# Altium project smart-ppe.PrjPcb (part 2 of 3)

## Sheet Power.SchDoc: Power
size C; Author: Alexander Curtiss; DocumentNumber: 3; SheetNumber: 3; SheetTotal: 6
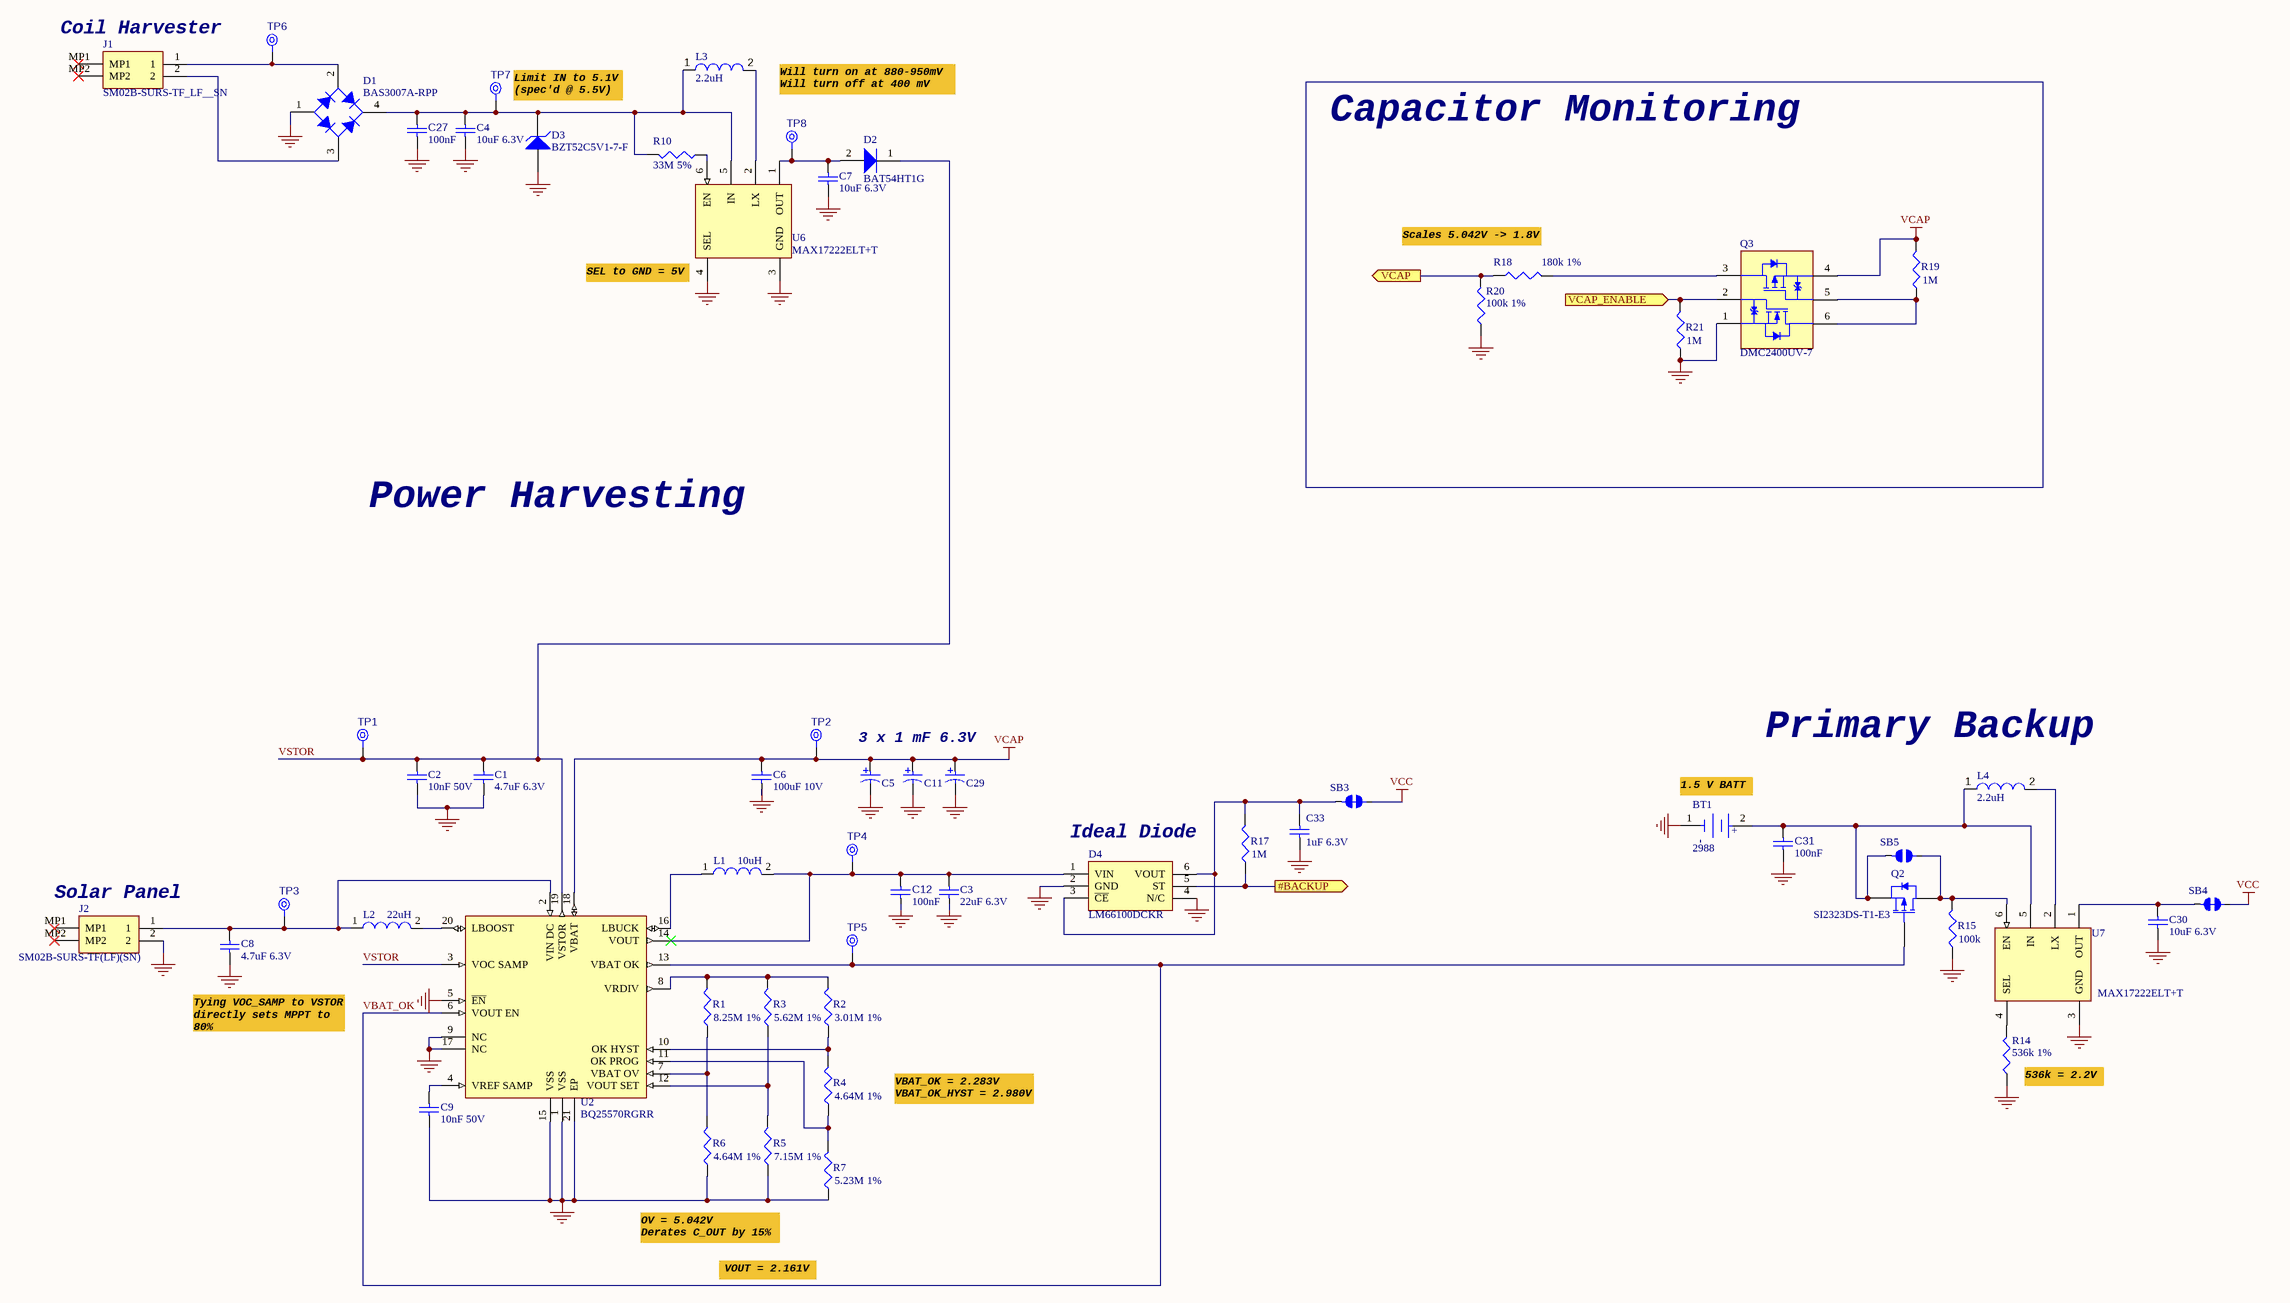
[diagram p4: Power.SchDoc]

### Parts
BT1  2988  [FP-2988-MFG]
C1  4.7uF 6.3V  [CAPC1005X55X25NL05T10]
C2  10nF 50V  [CAPC1005X55X25NL05T10]
C3  22uF 6.3V  [CAPC1608X100X20NL10]
C4  10uF 6.3V  [CAPC1608X90X35NL10T15]
C5  T495X108K006ATE100  [CAPM3216X18N]  (value not drawn)
C6  100uF 10V  [TDK-C3216-2_H1.9_M]
C7  10uF 6.3V  [CAPC1608X90X35NL10T15]
C8  4.7uF 6.3V  [CAPC1005X55X25NL05T10]
C9  10nF 50V  [CAPC1005X55X25NL05T10]
C11  T495X108K006ATE100  [CAPM3216X18N]  (value not drawn)
C12  value 100nF  [CAPC0402(1005)60_L]  (hidden comment: Capacitor 100nF +/-20% 25V 0402)
C27  value 100nF  [CAPC0402(1005)60_L]  (hidden comment: Capacitor 100nF +/-20% 25V 0402)
C29  T495X108K006ATE100  [CAPM3216X18N]  (value not drawn)
C30  10uF 6.3V  [CAPC1608X90X35NL10T15]
C31  value 100nF  [CAPC0402(1005)60_L]  (hidden comment: Capacitor 100nF +/-20% 25V 0402)
C33  1uF 6.3V  [CAPC1005X55X25ML5T10]
D1  BAS3007A-RPP  [INF-SOT143_V]
D2  BAT54HT1G  [ONSC-SOD-323-2-477-02_V]
D3  BZT52C5V1-7-F  [DIOD-SOD123_V]
D4  LM66100DCKR  [SOP65P210X110-6N]
J1  SM02B-SURS-TF_LF__SN  [SM02BSURSTFLFSN]
J2  SM02B-SURS-TF(LF)(SN)  [SM02BSURSTFLFSN]
L1  10uH  [WE-TPC-2813-TH]
L2  22uH  [WE-TPC-3816-S]
L3  Inductance: 2.2uH  [74438357022]  (hidden comment: 74438357022)
L4  Inductance: 2.2uH  [74438357022]  (hidden comment: 74438357022)
Q2  SI2323DS-T1-E3  [VISH-SI2323DS-T1-E3-3_V]
Q3  DMC2400UV-7  [DIOD-SOT563-6_V]
R1  8.25M 1%  [RESC1608X55X25NL10T15]
R2  3.01M 1%  [RESC1608X55X25NL10T15]
R3  5.62M 1%  [RESC1608X55X25NL10T15]
R4  4.64M 1%  [RESC1608X55X25NL10T15]
R5  7.15M 1%  [RESC1608X55X25NL10T15]
R6  4.64M 1%  [RESC1608X55X25NL10T15]
R7  5.23M 1%  [RESC1608X55X25NL10T15]
R10  33M 5%  [RESC1608X55X25NL10T15]
R14  536k 1%  [RESC1608X55X25NL10T15]
R15  100k  [RESC1608X55X25NL10T15]
R17  1M  [RESC1608X55X25NL10T15]
R18  180k 1%  [RESC1608X55X25NL10T15]
R19  1M  [RESC1608X55X25NL10T15]
R20  100k 1%  [RESC1608X55X25NL10T15]
R21  1M  [RESC1608X55X25NL10T15]
SB3  Solder Bridge NC  [Jumper NC-Footprint-1]  (value not drawn)  (net tie, no BOM)
SB4  Solder Bridge NC  [Jumper NC-Footprint-1]  (value not drawn)  (net tie, no BOM)
SB5  Solder Bridge  [Solder Bridge-Footprint-1]  (value not drawn)  (no BOM)
TP1  VSTOR  [TP06R]  (value not drawn)  (no BOM)
TP2  VBAT  [TP06R]  (value not drawn)  (no BOM)
TP3  HARVEST_IN  [TP06R]  (value not drawn)  (no BOM)
TP4  VOUT  [TP06R]  (value not drawn)  (no BOM)
TP5  VBAT_OK  [TP06R]  (value not drawn)  (no BOM)
TP6  VSTOR  [TP06R]  (value not drawn)  (no BOM)
TP7  VSTOR  [TP06R]  (value not drawn)  (no BOM)
TP8  VBAT  [TP06R]  (value not drawn)  (no BOM)
U2  BQ25570RGRR  [BQ25570RGRR-Footprint-1]
U6  MAX17222ELT+T  [MAX17222ELT+T]
U7  MAX17222ELT+T  [MAX17222ELT+T]

### Blocks framed on the sheet
Capacitor Monitoring: Q3 R18-R21

### Ports
#BACKUP (out), VCAP (out), VCAP_ENABLE (in)

### Nets
GND: BT1.1(C) C1.1 C2.1 C3.1 C4.1 C5.2 C6.1 C7.1 C8.1 C9.1 C11.2 C12.2 C27.2 C29.2 C30.1 C31.2 C33.1 D1.1(A) D3.1(A) D4.2(GND) D4.4(N/C) J2.2 Q3.1(S1) R5.1 R6.1 R7.1 R14.2 R15.1 R20.1 R21.1 U2.1(VSS) U2.5(~{EN}) U2.9(NC) U2.15(VSS) U2.17(NC) U2.21(EP) U6.3(GND) U6.4(SEL) U7.3(GND)
VCAP: C5.1 C6.2 C11.1 C29.1 Q3.4(S2) R19.2 TP2.1(TP) U2.18(VBAT)
VCC: SB3.2 SB4.2
VBAT_OK: Q2.1(G) TP5.1(TP) U2.6(VOUT_EN) U2.13(VBAT_OK)
VSTOR: C1.2 C2.2 D2.1(K) TP1.1(TP) U2.3(VOC_SAMP) U2.19(VSTOR)
NetBT1_2: BT1.2(A) C31.1 L4.1 Q2.2(S) SB5.1 U7.5(IN)
NetC3_2: C3.2 C12.1 D4.1(VIN) L1.2 TP4.1(TP) U2.14(VOUT)
NetC4_2: C4.2 C27.1 D1.4(K) D3.2(K) L3.1 R10.2 TP7.1(TP) U6.5(IN)
NetC7_2: C7.2 D2.2(A) TP8.1(TP) U6.1(OUT)
NetC8_2: C8.2 J2.1 L2.1 TP3.1(TP) U2.2(VIN_DC)
NetC9_2: C9.2 U2.4(VREF_SAMP)
NetC30_2: C30.2 SB4.1 U7.1(OUT)
NetC33_2: C33.2 D4.3(~{CE}) D4.6(VOUT) R17.2 SB3.1
NetD1_2: D1.2(C) J1.1 TP6.1(TP)
NetD1_3: D1.3(C) J1.2
NetD4_5: D4.5(ST) R17.1 ; port #BACKUP
NetL1_1: L1.1 U2.16(LBUCK)
NetL2_2: L2.2 U2.20(LBOOST)
NetL3_2: L3.2 U6.2(LX)
NetL4_2: L4.2 U7.2(LX)
NetQ2_3: Q2.3(D) R15.2 SB5.2 U7.6(EN)
NetQ3_2: Q3.2(G1) R21.2 ; port VCAP_ENABLE
NetQ3_3: Q3.3(D2) R18.2
NetQ3_5: Q3.5(G2) Q3.6(D1) R19.1
NetR1_1: R1.1 R6.2 U2.7(VBAT_OV)
NetR1_2: R1.2 R2.2 R3.2 U2.8(VRDIV)
NetR2_1: R2.1 R4.2 U2.10(OK_HYST)
NetR3_1: R3.1 R5.2 U2.12(VOUT_SET)
NetR4_1: R4.1 R7.2 U2.11(OK_PROG)
NetR10_1: R10.1 U6.6(EN)
NetR14_1: R14.1 U7.4(SEL)
NetR18_1: R18.1 R20.2 ; port VCAP

Not connected (* = marked no-connect by the designer): J1 MP1* MP2*; J2 MP1* MP2*

### Notes on the sheet
- (near J1) Coil Harvester
- (near TP7) Limit IN to 5.1V (spec'd @ 5.5V)
- Will turn on at 880-950mV
  Will turn off at 400 mV
- Scales 5.042V -> 1.8V
- (near U6) SEL to GND = 5V
- Power Harvesting
- 3 x 1 mF 6.3V
- (near BT1) 1.5 V BATT
- (near L4) Primary Backup
- (near D4) Ideal Diode
- (near J2) Solar Panel
- (near C8) Tying VOC_SAMP to VSTOR directly sets MPPT to 80%
- VBAT_OK = 2.283V
  VBAT_OK_HYST = 2.980V
- (near R14) 536k = 2.2V
- OV = 5.042V
  Derates C_OUT by 15%
- VOUT = 2.161V
- Title:
- Sheet
- of
- Project:
- Author:
- E-Mail:
- Date:
- Variant:
- Ka Moamoa
- Northwestern University
- http://kamoamoa.eecs.northwestern.edu/
- (in symbol CMP-19636-000008-1) +; -

### Library data of the parts
BT1 = CMP-19636-000008-1: BATTERY RETAINER COIN 7.9MM SMD; Number of Cells: 1; Mount: Surface Mount; Number of Batteries: 1; Package Quantity: 100; Termination: SMD/SMT; REACH SVHC: No SVHC; Case/Package: SMD/SMT
C1 C8 = CMP-2008-04549-1: Part Number: GRM155R60J475ME47D; Manufacturer: Murata
C2 C9 = CMP-2008-04637-4: Chip Capacitor, 10 nF, +/- 10%, 50 V, -55 to 125 degC, 0402 (1005 Metric), RoHS, Tape and Reel; PartNumber: GRM155R71H103KA88D; Manufacturer: Basic Passives; Case\/Package: 0402; Type (Capacitors): X7R; DatasheetVersion: 02/2016; Capacitance: 10 nF; Mount: Surface Mount; Max Operating Temperature: 125 degC; ComponentLink1Description: Manufacturer URL; Voltage Rating: 50 V; Package Quantity: 10000; Mounting Technology: Surface Mount; Radiation Hardening: No; Lead Pitch: 2mm; Length: 1 mm; Tolerance: 10%; Voltage Rating (DC): 50 V; Case Code (Metric): 1005; Packaging: Tape and Reel; Pins: 2; Width: 0.5 mm; PackageDescription: 2-Pin Surface Mount Device, Body 1 x 0.5 mm; ComponentLink1URL: http://www.murata.com/; Min Operating Temperature: -55 degC; Height: 0.5 mm; RoHSCompliant: true; Case Code (Imperial): 0402; ComponentLink2URL: http://search.murata.co.jp/Ceramy/image/img/A01X/G101/ENG/GRM155R71H103KA88-01.pdf; ComponentLink2Description: Datasheet; PackageReference: 0402; REACH SVHC: No SVHC
C3 = CMP-2000-05440-1: Chip Capacitor, 22 uF, +/- 20%, 6.3 V, -55 to 85 degC, 1608 (0603 Metric), RoHS, Tape and Reel; PCN Part Number: MLCCPartNumberChange30/Nov/2012; Manufacturer: TDK; Temperature Coefficient: X5R; Product Training Modules: CSeriesGeneralApplicationsSEAT,CCV,andTVCLDesignToolsGuidetoReplacinganElectrolyticCapacitorwithanMLCC; Other Names: 445-8028-1; Capacitance: 22µF; Design Resources: 20WNon-IsolatedBuckLEDDriverUsingPLLNK460KG; Online Catalog: CSeries,GeneralPurpose; Kits: 445-9003-KIT-ND-KITCAPCERHICAPMLCCSMD; Tolerance: ±20%; Series: C; Thickness (Max): 0.039"(1.00mm); Voltage - Rated: 6.3V; Mounting Type: SurfaceMount,MLCC; Ratings: -; Datasheet Version: Mar-15; Package Reference: 603; Packaging: CutTape(CT); Features: -; Package / Case: 0603(1608Metric); Family: CeramicCapacitors; Lead Spacing: -; RoHS Information: RoHSCertificate-MLCC; Manufacturer URL: http://www.tdk.com/; Lead Style: -; Category: Capacitors; Applications: GeneralPurpose; Package Description: 2-Pin Surface Mount Device, Body 1.6 x 0.8 mm; Standard Package: 1; Datasheet URL: http://www.farnell.com/datasheets/1913358.pdf; Height - Seated (Max): -; Operating Temperature: -55degC~85degC; Size / Dimension: 0.063"Lx0.031"W(1.60mmx0.80mm)
C4 C7 C30 = CMP-2006-02792-1: Part Number: GRM188R60J106ME47D; Manufacturer: Murata
C5 C11 C29 = CMP-001-00088-1: CAP TANT 1000UF 10% 6.3V 2917; Capacitance: 1mF; Life (Hours): 2000Hour; ESR (Equivalent Series Resistance): 100mR; Mount: Surface Mount; Voltage Rating: 6.3V; Features: General Purpose; REACH SVHC: No SVHC; Package Quantity: 1; Height: 4mm; Tolerance: 10%; Height - Seated (Max): 0.169inch; Radiation Hardening: No; Case Code (Metric): 7343; Lead Free: Lead Free; Packaging: Cut Tape; Length: 0.287inch; Min Operating Temperature: -55°C; Depth: 4.3mm; Max Operating Temperature: 125°C; Width: 0.169inch; Voltage Rating (DC): 6.3V; Case/Package: 2917; Case Code (Imperial): 2917
C6 = CMP-2000-05396-1: Chip Capacitor, 100 uF, +/- 20%, 10 V, -55 to 85 degC, 1206 (3216 Metric), RoHS, Tape and Reel; PCN Part Number: MLCCPartNumberChange30/Nov/2012; Manufacturer: TDK; Online Catalog: CSeries,GeneralPurpose; Temperature Coefficient: X5R; Capacitance: 100µF; Kits: 445-9003-KIT-ND-KITCAPCERHICAPMLCCSMD445-9004-KIT-ND-KITCAPCERHICAPMLCCSMD445-172627-KIT-ND-KITMLCC.22UF-100UF10-50V; Catalog Drawings: CSERIES_1206_1.8; Other Names: 445-6007-1; Product Training Modules: CSeriesGeneralApplicationsSEAT,CCV,andTVCLDesignToolsGuidetoReplacinganElectrolyticCapacitorwithanMLCC; Package / Case: 1206(3216Metric); Lead Spacing: -; Datasheet Version: Sep-13; Size / Dimension: 0.126"Lx0.063"W(3.20mmx1.60mm); Applications: GeneralPurpose; Features: -; Packaging: CutTape(CT); Height - Seated (Max): -; Standard Package: 1; Manufacturer URL: http://www.tdk.com/; Operating Temperature: -55degC~85degC; Voltage - Rated: 10V; Ratings: -; Series: C; Lead Style: -; Mounting Type: SurfaceMount,MLCC; Family: CeramicCapacitors; RoHS Information: RoHSCertificate-MLCC; Datasheet URL: https://datasheet.ciiva.com/24216/c3216x5r1a107m160ac-265050-24216592.pdf; Tolerance: ±20%; Thickness (Max): 0.075"(1.90mm); Category: Capacitors
C12 C27 C31 = CMP-001-00065-2: Chip Capacitor, 100nF +/-20%, 25V, 0402, Thickness 0.6 mm; Tolerance: 10%; Pins: 2; Min Operating Temperature: -55°C; Max Operating Temperature: 85°C; Mounting Technology: SMT; Case/Package: 0603; Voltage Rating: 25V
C33 = CMP-2100-03591-1: Chip Capacitor, 1 uF, +/- 10%, 6.3 V, -55 to 85 degC, 1005 (0402 Metric), RoHS, Tape and Reel; Manufacturer: Yageo; Dielectric: X5R; Dielectric Material: Ceramic; Number of Pins: 2; Lead Free: LeadFree; Voltage Rating (DC): 6.3V; RoHSCompliant: True; Manufacturer URL: http://www.yageo.com/; Package Reference: 0402; REACH SVHC: NoSVHC; Tolerance: 10%; Case Code (Imperial): 0402; Width: 0.02inch; Case Code (Metric): 1005; Thickness: 0.022inch; Packaging: TapeandReel; Voltage Rating: 6.3V; Case/Package: 0402; Depth: 0.5mm; Max Operating Temperature: 85degC; Datasheet URL: http://www.yageo.com/documents/recent/UPY-GPHC_X5R_4V-to-50V_22.pdf; Composition: Ceramic; Length: 1mm; Radiation Hardening: No; Capacitance: 1uF; Height: 0.5mm; Mount: SurfaceMount; Datasheet Version: Rev. 22, 10/2016; Package Quantity: 1; Package Description: 2-Pin Surface Mount Device, Body 1 x 0.5 mm; Termination: SMD/SMT; Min Operating Temperature: -55degC
D1 = CMP-1188-00001-1: Low VF Schottky Diode Array, 30 V VR, 900 mA IF, SOT143, Reel, Green; Manufacturer: Infineon; IF (max): 900Â mA; IR (max): 350Â uA; Green: TRUE; VR (max): 30Â V; VF (max): 0.6Â V; Mounting Technology: Surface Mount; ComponentLink1Description: Manufacturer URL; ComponentLink2Description: Datasheet; ComponentLink3Description: Package Specification; ComponentLink1URL: http://www.infineon.com/; PartNumber: BAS3007A-RPP; Packing: Reel; ComponentLink2URL: http://www.infineon.com/dgdl/bas3007aseries.pdf?folderId=db3a304313d846880113def5812204a1&fileId=db3a3043156fd5730115a286aa19083b; PackageReference: SOT143; PackageDescription: 4-Pin Small Outline Transistor Package, 1.3 x 2.9 mm Body; ComponentLink3URL: http://www.infineon.com/dgdl/SOT143-Package_Overview.pdf?folderId=db3a30431936bc4b011952ce8b1b3bed&fileId=db3a30431936bc4b011952df42203c0c
D2 = CMP-1055-00462-1: Schottky Barrier Diode, 2-Pin SOD-323, Pb-Free, Tape and Reel; Manufacturer: On Semiconductor; Configuration: Single; trr Max (ns): 5; IFSM Max (A): 0.6; ComponentLink3URL: http://www.onsemi.com/pub_link/Collateral/477-02.PDF.1; PackageDescription: 2-Pin SOD, Body 1.7 x 1.25 mm; ComponentLink2URL: http://www.onsemi.cn/pub_link/Collateral/BAT54HT1-D.PDF; ComponentLink3Description: Package Specification; ComponentLink2Description: Datasheet; DatasheetVersion: Rev. 6; PackageReference: SOD-323-2-477-02; RoHS: TRUE; ComponentLink1URL: http://www.onsemi.com/; Packing: Tape and Reel; PartNumber: BAT54HT1G; Mounting Technology: Surface Mount; ComponentLink1Description: Manufacturer URL; PackageVersion: Rev. H, 03/2007
D3 = CMP-2000-05976-1: Surface Mount Zener Diode, 5.1 V, -65 to 150 degC, 2-Pin SMD (SOD-123), RoHS, Tape and Reel; Manufacturer: DiodesIncorporated; Unit Weight: 0.000353oz; Zz - Zener Impedance: 60Ohms; Vz - Zener Voltage: 5.1V; Pd - Power Dissipation: 500mW; Zener Current: 5mA; Ir - Reverse Current: 2uA; Voltage Temperature Coefficient: -0.75mV/C; Configuration: Single; Voltage Tolerance: 6%; Height: 1.35mm; Width: 1.7mm; Minimum Operating Temperature: -65C; Series: BZT52C5; Package Description: 2-Pin Surface Mount Device, Body 2.7 x 1.55 mm; Length: 2.85mm; Mounting Technology: SurfaceMount; Brand: DiodesIncorporated; Factory Pack Quantity: 3000; Product Category: ZenerDiodes; RoHS: True; Manufacturer URL: http://www.diodes.com/; Termination Style: SMD/SMT; Package / Case: SOD-123; Packaging: Reel; Package Reference: SOD123; Datasheet Version: Rev. 37-2, 09/2012; Maximum Operating Temperature: +150C; Datasheet URL: http://www.diodes.com/_files/datasheets/ds18004.pdf; Mounting Style: SMD/SMT
D4 = LM66100DCKR: Diode; Manufacturer_Name: Texas Instruments; Datasheet Link: http://www.ti.com/lit/gpn/LM66100; Height: 1.1mm; Manufacturer_Part_Number: LM66100DCKR; Arrow Part Number: LM66100DCKR; Arrow Price/Stock: https://www.arrow.com/en/products/lm66100dckr/texas-instruments; Mouser Part Number: 595-LM66100DCKR; Mouser Price/Stock: https://www.mouser.co.uk/ProductDetail/Texas-Instruments/LM66100DCKR?qs=vLWxofP3U2y2yPPrXoBBoA%3D%3D; Supplier 1: Digi-Key; Supplier Part Number 1: 296-53541-1-ND
J1 = SM02B-SURS-TF_LF__SN_: Connector; Manufacturer 1: JST (JAPAN SOLDERLESS TERMINALS); Manufacturer Part Number 1: SM02B-SURS-TF(LF)(SN); Datasheet Link: http://www.farnell.com/datasheets/2083122.pdf; Height: 1.75mm; Arrow Part Number: SM02B-SURS-TF(LF)(SN); Arrow Price/Stock: https://www.arrow.com/en/products/sm02b-surs-tf-lf-sn/jst-manufacturing
J2 = SM02B-SURS-TF_LF__SN_: Connector; Manufacturer 1: JST (JAPAN SOLDERLESS TERMINALS); Datasheet Link: http://www.farnell.com/datasheets/2083122.pdf; Height: 1.75mm; Manufacturer Part Number 1: SM02B-SURS-TF(LF)(SN); Arrow Part Number: SM02B-SURS-TF(LF)(SN); Arrow Price/Stock: https://www.arrow.com/en/products/sm02b-surs-tf-lf-sn/jst-manufacturing
L1 = CMP-0227-00077-1: SMD Shielded Tiny Power Inductor WE-TPC, L = 10.0 µH; Inductance: 10.0 ÂµH; ComponentLink1Description: Manufacturer Link; PackageReference: WE-TPC-2813-TH; PackageDescription: SMD Inductor, 2-Leads, Body 2.8 x 2.8 mm; ComponentLink1URL: http://www.we-online.com; ComponentLink2URL: http://www.we-online.de/katalog/media/pdf/744029100.pdf; PackageVersion: 2010; DatasheetVersion: ver 3, Oct-2010; ComponentLink2Description: Datasheet
L2 = CMP-0227-00346-1: SMD Shielded Tiny Power Inductor WE-TPC, L = 22.0 µH; Inductance: 22.0 ÂµH; ComponentLink1URL: http://www.we-online.com; PackageReference: WE-TPC-3816-S; ComponentLink1Description: Manufacturer Link; PackageVersion: 2009; ComponentLink2URL: http://www.we-online.de/katalog/media/pdf/744031220.pdf; PackageDescription: SMD Inductor, 2-Leads, Body 3.8 x 3.8 mm; ComponentLink2Description: Datasheet; DatasheetVersion: ver 6, Jan-2009
L3 L4 = CMP-006-00021-1: WURTH ELEKTRONIK - 74438357022 - INDUCTOR, 2.2UH, 5.2A, 20%, SHIELDED; DC Resistance (DCR): 26mR; Test Frequency: 100kHz; Saturation Current: 7A; Core Material: Metal,Composite; Self Resonant Frequency: 35MHz; Packaging: Cut Tape; Min Operating Temperature: -40°C; Mount: Surface Mount; Current Rating: 5.2A; Tolerance: 20%; Shielding: Shielded; Case/Package: Nonstandard; Max Operating Temperature: 125°C
Q2 = CMP-2000-07054-1: P-Channel MOSFET, 20 V, -55 to 150 degC, 3-Pin TO-236, RoHS, Tape and Reel; Manufacturer: Vishay; Vgs - Gate-Source Voltage: 8V; Fall Time: 43ns; Brand: VishaySemiconductors; Vds - Drain-Source Breakdown Voltage: -20V; Unit Weight: 0.050717oz; Number of Channels: 1Channel; Pd - Power Dissipation: 750mW; Rds On - Drain-Source Resistance: 39mOhms; Transistor Type: 1P-Channel; Channel Mode: Enhancement; Configuration: Single; Typical Turn-On Delay Time: 25ns; Id - Continuous Drain Current: 3.7A; Typical Turn-Off Delay Time: 71ns; Mounting Technology: SurfaceMount; Package / Case: SOT-23-3; Minimum Operating Temperature: -55C; RoHS: True; Package Reference: TO-236-3; Datasheet Version: Rev. D, 02/2009; Maximum Operating Temperature: +150C; Height: 1.02mm; Product: MOSFETSmallSignal; Manufacturer URL: http://www.vishay.com/; Technology: Si; Mounting Style: SMD/SMT; Package Description: 3-Pin Plastic Small Outline, Body 2.92 x1.3 mm, Pitch 0.95 mm; Tradename: TrenchFET; Length: 3.04mm; Width: 1.4mm; Series: SI2; Package URL: https://www.vishay.com/docs/71196/71196.pdf; Transistor Polarity: P-Channel; Packaging: Reel; Product Category: MOSFET; Factory Pack Quantity: 3000; Datasheet URL: https://datasheet.ciiva.com/15137/getdatasheetpartid-75162-15137380.pdf; Rise Time: 43ns
Q3 = CMP-2000-06168-1: Complementary Pair Enhancement Mode MOSFET, 20 V N-Channel, -20 V P-Channel, -55 to 150 degC, 6-Pin SOTFL (SOT563), RoHS, Tape and Reel; Manufacturer: Diodes Inc; Channel Type: N,P; Maximum Power Dissipation: 1W; Typical Gate Charge @ Vgs: 0.5nC@4.5V; Typical Input Capacitance @ Vds: 37.1pF@10V; Maximum Gate Source Voltage: ±12(Q1)V,±8(Q2)V; Maximum Drain Source Resistance: 1.5Ω; Transistor Material: Si; Maximum Continuous Drain Current: 0.7A,1A; Typical Turn-Off Delay Time: 13.74ns; Number of Elements per Chip: 2; Maximum Drain Source Voltage: 20V; Maximum Gate Threshold Voltage: 1V; Transistor Configuration: Isolated; Typical Turn-On Delay Time: 4.06ns; Length: 1.7mm; Height: 0.6mm; Width: 1.25mm; Pin Count: 6; Minimum Operating Temperature: -55°C; Dimensions: 1.7x1.25x0.6mm; Package Type: SOT-563; Category: PowerMOSFET; Maximum Operating Temperature: +150°C; Manufacturer URL: http://www.diodes.com/; Channel Mode: Enhancement; Package Reference: SOT563-6; Mounting Technology: SurfaceMount; Datasheet URL: http://www.diodes.com/_files/datasheets/DMC2400UV.pdf; Package Description: 6-Pin Small Outline Transistor, Flat Lead, Body 1.175 x 1.6 mm, Pitch 0.5 mm; Mounting Type: SurfaceMount; Datasheet Version: Rev. 7-2, 06/2013
R1 = CMP-009-00177-2: Resistor Ω % 0603; Manufacturer 1: Vishay; Manufacturer Part Number 1: CRCW06038M25FKEA; Resistance: 8.25MR; Temperature Coefficient: 100ppm/°C; Max Power Dissipation: 100mW; Voltage Rating (DC): 75V; Supplier 1: Digi-Key; Supplier Part Number 1: 541-8.25MHCT-ND; RoHS: Yes; Category: Chip SMD Resistors; Stock 1: 14263; Pricing 1: 1=0.10000, 10=0.03100, 100=0.01260, 1000=0.00567, 2500=0.00492 (USD); Case/Package: 0603; Contact Plating: Tin; Case Code (Metric): 1608; Case Code (Imperial): 0603; Weight: 7.1E-05oz; Min Operating Temperature: -55°C; Max Operating Temperature: 155°C; Tolerance: 1%; Resistor Type: Thick Film; Packaging: Tape and Reel; Features: Automotive AEC-Q200; Number of Terminations: 2; Power Rating: 100mW; Package Quantity: 10; Voltage Rating: 75V; Termination: SMD/SMT; Length: 1.55mm; Width: 0.033inch; Height: 0.02inch; Depth: 0.85mm; Radiation Hardening: No; Lead Free: Lead Free; Military Standard: Not; REACH SVHC: Unknown; ComponentLink1URL: https://datasheet.ciiva.com/2513/dcrcwe3-2513731.pdf?src-supplier=Digi-Key; ComponentLink1Description: https://datasheet.ciiva.com/2513/dcrcwe3-2513731.pdf?src-supplier=Digi-Key; ComponentLink2URL: https://datasheet.ciiva.com/2513/dcrcwe3-2513732.pdf?src-supplier=Digi-Key; ComponentLink2Description: https://datasheet.ciiva.com/2513/dcrcwe3-2513732.pdf?src-supplier=Digi-Key; ComponentLink3URL: https://datasheet.ciiva.com/2513/dcrcwe3-2513733.pdf?src-supplier=Digi-Key; ComponentLink3Description: https://datasheet.ciiva.com/2513/dcrcwe3-2513733.pdf?src-supplier=Digi-Key; ComponentLink4URL: https://datasheet.ciiva.com/7748/1697337-7748717.pdf?src-supplier=Element14; ComponentLink4Description: https://datasheet.ciiva.com/7748/1697337-7748717.pdf?src-supplier=Element14; ComponentLink5URL: https://datasheet.ciiva.com/7748/1697337-7748718.pdf?src-supplier=Element14; ComponentLink5Description: https://datasheet.ciiva.com/7748/1697337-7748718.pdf?src-supplier=Element14
R2 = CMP-009-00177-2: Resistor 3.01MΩ 1% 0603; Manufacturer 1: Vishay; Manufacturer Part Number 1: CRCW06033M01FKEA; Resistance: 3.01MR; Temperature Coefficient: 100ppm/°C; Max Power Dissipation: 100mW; Voltage Rating (DC): 75V; Supplier 1: Digi-Key; Supplier Part Number 1: 541-3.01MHCT-ND; RoHS: Yes; Category: Chip SMD Resistors; Stock 1: 17260; Pricing 1: 1=0.10000, 10=0.03100, 100=0.01260, 1000=0.00567, 2500=0.00492 (USD); Case/Package: 0603; Number of Pins: 2; Case Code (Imperial): 0603; Case Code (Metric): 1608; Contact Plating: Tin; Weight: 7.1E-05oz; Min Operating Temperature: -55°C; Max Operating Temperature: 155°C; Tolerance: 1%; Resistor Type: Thick Film; Packaging: Tape and Reel; Number of Terminations: 2; Power Rating: 100mW; Features: Automotive AEC-Q200; Package Quantity: 10; Voltage Rating: 75V; Termination: SMD/SMT; Length: 1.55mm; Width: 0.85mm; Height: 0.45mm; Depth: 0.85mm; Radiation Hardening: No; Lead Free: Lead Free; Military Standard: Not; REACH SVHC: Unknown; ComponentLink1URL: https://datasheet.ciiva.com/3257/dcrcwe3-3257558.pdf?src-supplier=Avnet; ComponentLink1Description: https://datasheet.ciiva.com/3257/dcrcwe3-3257558.pdf?src-supplier=Avnet; ComponentLink2URL: https://datasheet.ciiva.com/5547/dcrcwe3-109170-5547783.pdf?src-supplier=Mouser; ComponentLink2Description: https://datasheet.ciiva.com/5547/dcrcwe3-109170-5547783.pdf?src-supplier=Mouser; ComponentLink3URL: https://datasheet.ciiva.com/16760/70201119-16760039.pdf?src-supplier=Allied+Electronics; ComponentLink3Description: https://datasheet.ciiva.com/16760/70201119-16760039.pdf?src-supplier=Allied+Electronics; ComponentLink4URL: https://datasheet.ciiva.com/22708/1697337-22708345.pdf?src-supplier=Element14; ComponentLink4Description: https://datasheet.ciiva.com/22708/1697337-22708345.pdf?src-supplier=Element14; ComponentLink5URL: https://datasheet.ciiva.com/2466/dcrcwe3-2466698.pdf?src-supplier=Digi-Key; ComponentLink5Description: https://datasheet.ciiva.com/2466/dcrcwe3-2466698.pdf?src-supplier=Digi-Key; ComponentLink6URL: https://datasheet.ciiva.com/7801/1697337-7801098.pdf?src-supplier=Element14; ComponentLink6Description: https://datasheet.ciiva.com/7801/1697337-7801098.pdf?src-supplier=Element14; ComponentLink7URL: https://datasheet.ciiva.com/2466/dcrcwe3-2466699.pdf?src-supplier=Digi-Key; ComponentLink7Description: https://datasheet.ciiva.com/2466/dcrcwe3-2466699.pdf?src-supplier=Digi-Key; ComponentLink8URL: https://datasheet.ciiva.com/7801/1697337-7801099.pdf?src-supplier=Element14; ComponentLink8Description: https://datasheet.ciiva.com/7801/1697337-7801099.pdf?src-supplier=Element14; ComponentLink9URL: https://datasheet.ciiva.com/2466/dcrcwe3-2466700.pdf?src-supplier=Digi-Key; ComponentLink9Description: https://datasheet.ciiva.com/2466/dcrcwe3-2466700.pdf?src-supplier=Digi-Key; ComponentLink10URL: https://datasheet.ciiva.com/16430/dcrcwe3-16430156.pdf?src-supplier=Future+Electronics; ComponentLink10Description: https://datasheet.ciiva.com/16430/dcrcwe3-16430156.pdf?src-supplier=Future+Electronics
R3 = CMP-009-00177-2: Resistor 5.62Ω 1% 0603; Manufacturer 1: Vishay; Manufacturer Part Number 1: CRCW06035M62FKEA; Power Rating: 100mW; Resistance: 5.62MR; Voltage Rating: 75V; Temperature Coefficient: 100ppm/°C; Supplier 1: Digi-Key; Supplier Part Number 1: 541-5.62MHCT-ND; RoHS: Yes; Category: Chip SMD Resistors; Stock 1: 47408; Pricing 1: 1=0.10000, 10=0.03100, 100=0.01260, 1000=0.00567, 2500=0.00492 (USD); Case/Package: 0603; Number of Pins: 2; Case Code (Metric): 1608; Case Code (Imperial): 0603; Weight: 7.1E-05oz; Contact Plating: Tin; Min Operating Temperature: -55°C; Max Operating Temperature: 155°C; Tolerance: 1%; Packaging: Tape and Reel; Resistor Type: Thick Film; Voltage Rating (DC): 75V; Package Quantity: 10; Max Power Dissipation: 100mW; Features: Automotive AEC-Q200; Number of Terminations: 2; Length: 1.55mm; Width: 0.033inch; Height: 0.02inch; Depth: 0.85mm; Lead Free: Lead Free; REACH SVHC: Unknown; Military Standard: Not; ComponentLink1URL: https://datasheet.ciiva.com/2525/dcrcwe3-2525254.pdf?src-supplier=Digi-Key; ComponentLink1Description: https://datasheet.ciiva.com/2525/dcrcwe3-2525254.pdf?src-supplier=Digi-Key; ComponentLink2URL: https://datasheet.ciiva.com/2525/dcrcwe3-2525255.pdf?src-supplier=Digi-Key; ComponentLink2Description: https://datasheet.ciiva.com/2525/dcrcwe3-2525255.pdf?src-supplier=Digi-Key; ComponentLink3URL: https://datasheet.ciiva.com/7748/1697337-7748679.pdf?src-supplier=Element14; ComponentLink3Description: https://datasheet.ciiva.com/7748/1697337-7748679.pdf?src-supplier=Element14; ComponentLink4URL: https://datasheet.ciiva.com/2525/dcrcwe3-2525256.pdf?src-supplier=Digi-Key; ComponentLink4Description: https://datasheet.ciiva.com/2525/dcrcwe3-2525256.pdf?src-supplier=Digi-Key; ComponentLink5URL: https://datasheet.ciiva.com/7748/1697337-7748680.pdf?src-supplier=Element14; ComponentLink5Description: https://datasheet.ciiva.com/7748/1697337-7748680.pdf?src-supplier=Element14; ComponentLink6URL: https://datasheet.ciiva.com/5546/dcrcwe3-109170-5546746.pdf?src-supplier=Mouser; ComponentLink6Description: https://datasheet.ciiva.com/5546/dcrcwe3-109170-5546746.pdf?src-supplier=Mouser; ComponentLink7URL: https://datasheet.ciiva.com/9065/dcrcwe3-9065258.pdf?src-supplier=Avnet; ComponentLink7Description: https://datasheet.ciiva.com/9065/dcrcwe3-9065258.pdf?src-supplier=Avnet; ComponentLink8URL: https://datasheet.ciiva.com/22700/1697337-22700634.pdf?src-supplier=Element14; ComponentLink8Description: https://datasheet.ciiva.com/22700/1697337-22700634.pdf?src-supplier=Element14; ComponentLink9URL: https://datasheet.ciiva.com/22675/1700796-22675468.pdf?src-supplier=Element14; ComponentLink9Description: https://datasheet.ciiva.com/22675/1700796-22675468.pdf?src-supplier=Element14; ComponentLink10URL: https://datasheet.ciiva.com/22675/1700796-22675469.pdf?src-supplier=Element14; ComponentLink10Description: https://datasheet.ciiva.com/22675/1700796-22675469.pdf?src-supplier=Element14
R4 = CMP-009-00177-2: =Comment; Manufacturer 1: Stackpole Electronics; Manufacturer Part Number 1: RMCF0603FT4M64; Resistance: 4.64MR; Temperature Coefficient: 200ppm/°C; Max Power Dissipation: 100mW; Supplier 1: Digi-Key; Supplier Part Number 1: RMCF0603FT4M64CT-ND; RoHS: Yes; Category: Chip SMD Resistors; Stock 1: 8268; Pricing 1: 1=0.10000, 10=0.02200, 100=0.00890, 1000=0.00398, 2500=0.00345 (USD); Mount: Surface Mount; Case/Package: 0603; Contact Plating: Tin,Matte; Min Operating Temperature: -55°C; Max Operating Temperature: 155°C; Tolerance: 1%; Resistor Type: Thick Film; Packaging: Tape and Reel; Features: Automotive AEC-Q200; Number of Terminations: 2; Package Quantity: 5000; Length: 0.061inch; Width: 0.031inch; Height: 0.022inch; Radiation Hardening: No; ComponentLink1URL: https://www.seielect.com/catalog/sei-rmcf_rmcp.pdf?src-supplier=Digi-Key; ComponentLink1Description: https://www.seielect.com/catalog/sei-rmcf_rmcp.pdf?src-supplier=Digi-Key; ComponentLink2URL: https://www.seielect.com/catalog/SEI-RMCF_RMCP.pdf?src-supplier=Avnet; ComponentLink2Description: https://www.seielect.com/catalog/SEI-RMCF_RMCP.pdf?src-supplier=Avnet
R5 = CMP-009-00177-2: Resistor 7.15MΩ 1% 0603; Manufacturer 1: Vishay; Manufacturer Part Number 1: CRCW06037M15FKEA; Resistance: 7.15MR; Power Rating: 100mW; Temperature Coefficient: 100ppm/°C; Voltage Rating (DC): 75V; Supplier 1: Digi-Key; Supplier Part Number 1: 541-7.15MHCT-ND; RoHS: Yes; Category: Chip SMD Resistors; Stock 1: 17700; Pricing 1: 1=0.10000, 10=0.03100, 100=0.01260, 1000=0.00567, 2500=0.00492 (USD); Case/Package: 0603; Case Code (Metric): 1608; Case Code (Imperial): 0603; Weight: 7.1E-05oz; Contact Plating: Tin; Min Operating Temperature: -55°C; Max Operating Temperature: 155°C; Tolerance: 1%; Packaging: Tape and Reel; Resistor Type: Thick Film; Number of Terminations: 2; Max Power Dissipation: 100mW; Features: Automotive AEC-Q200; Voltage Rating: 75V; Package Quantity: 10; Length: 1.55mm; Width: 0.033inch; Height: 0.02inch; Depth: 0.85mm; Lead Free: Lead Free; REACH SVHC: Unknown; Military Standard: Not; ComponentLink1URL: https://datasheet.ciiva.com/2494/dcrcwe3-2494708.pdf?src-supplier=Digi-Key; ComponentLink1Description: https://datasheet.ciiva.com/2494/dcrcwe3-2494708.pdf?src-supplier=Digi-Key; ComponentLink2URL: https://datasheet.ciiva.com/2494/dcrcwe3-2494709.pdf?src-supplier=Digi-Key; ComponentLink2Description: https://datasheet.ciiva.com/2494/dcrcwe3-2494709.pdf?src-supplier=Digi-Key; ComponentLink3URL: https://datasheet.ciiva.com/7748/1697337-7748703.pdf?src-supplier=Element14; ComponentLink3Description: https://datasheet.ciiva.com/7748/1697337-7748703.pdf?src-supplier=Element14; ComponentLink4URL: https://datasheet.ciiva.com/2494/dcrcwe3-2494710.pdf?src-supplier=Digi-Key; ComponentLink4Description: https://datasheet.ciiva.com/2494/dcrcwe3-2494710.pdf?src-supplier=Digi-Key; ComponentLink5URL: https://datasheet.ciiva.com/16435/dcrcwe3-16435959.pdf?src-supplier=Future+Electronics; ComponentLink5Description: https://datasheet.ciiva.com/16435/dcrcwe3-16435959.pdf?src-supplier=Future+Electronics; ComponentLink6URL: https://datasheet.ciiva.com/7792/1700796-7792409.pdf?src-supplier=Element14; ComponentLink6Description: https://datasheet.ciiva.com/7792/1700796-7792409.pdf?src-supplier=Element14; ComponentLink7URL: https://datasheet.ciiva.com/5542/dcrcwe3-109170-5542876.pdf?src-supplier=Mouser; ComponentLink7Description: https://datasheet.ciiva.com/5542/dcrcwe3-109170-5542876.pdf?src-supplier=Mouser; ComponentLink8URL: https://datasheet.ciiva.com/9059/dcrcwe3-9059421.pdf?src-supplier=Avnet; ComponentLink8Description: https://datasheet.ciiva.com/9059/dcrcwe3-9059421.pdf?src-supplier=Avnet; ComponentLink9URL: https://datasheet.ciiva.com/22704/1697337-22704014.pdf?src-supplier=Element14; ComponentLink9Description: https://datasheet.ciiva.com/22704/1697337-22704014.pdf?src-supplier=Element14
R6 = CMP-009-00177-2: Resistor Ω % 0603; Manufacturer 1: Stackpole Electronics; Manufacturer Part Number 1: RMCF0603FT4M64; Resistance: 4.64MR; Temperature Coefficient: 200ppm/°C; Max Power Dissipation: 100mW; Supplier 1: Digi-Key; Supplier Part Number 1: RMCF0603FT4M64CT-ND; RoHS: Yes; Category: Chip SMD Resistors; Stock 1: 8268; Pricing 1: 1=0.10000, 10=0.02200, 100=0.00890, 1000=0.00398, 2500=0.00345 (USD); Mount: Surface Mount; Case/Package: 0603; Contact Plating: Tin,Matte; Min Operating Temperature: -55°C; Max Operating Temperature: 155°C; Tolerance: 1%; Resistor Type: Thick Film; Packaging: Tape and Reel; Features: Automotive AEC-Q200; Number of Terminations: 2; Package Quantity: 5000; Length: 0.061inch; Width: 0.031inch; Height: 0.022inch; Radiation Hardening: No; ComponentLink1URL: https://www.seielect.com/catalog/sei-rmcf_rmcp.pdf?src-supplier=Digi-Key; ComponentLink1Description: https://www.seielect.com/catalog/sei-rmcf_rmcp.pdf?src-supplier=Digi-Key; ComponentLink2URL: https://www.seielect.com/catalog/SEI-RMCF_RMCP.pdf?src-supplier=Avnet; ComponentLink2Description: https://www.seielect.com/catalog/SEI-RMCF_RMCP.pdf?src-supplier=Avnet
R7 = CMP-009-00177-2: Resistor Ω % 0603; Manufacturer 1: Vishay; Manufacturer Part Number 1: CRCW06035M23FKEA; Resistance: 5.23MR; Temperature Coefficient: 100ppm/°C; Max Power Dissipation: 100mW; Voltage Rating (DC): 75V; Supplier 1: Digi-Key; Supplier Part Number 1: 541-5.23MHCT-ND; RoHS: Yes; Category: Chip SMD Resistors; Stock 1: 13405; Pricing 1: 1=0.10000, 10=0.03100, 100=0.01260, 1000=0.00567, 2500=0.00492 (USD); Case/Package: 0603; Number of Pins: 2; Contact Plating: Tin; Case Code (Metric): 1608; Case Code (Imperial): 0603; Weight: 7.1E-05oz; Min Operating Temperature: -55°C; Max Operating Temperature: 155°C; Tolerance: 1%; Resistor Type: Thick Film; Packaging: Tape and Reel; Number of Terminations: 2; Features: Automotive AEC-Q200; Power Rating: 100mW; Package Quantity: 10; Voltage Rating: 75V; Length: 1.55mm; Width: 0.033inch; Height: 0.02inch; Depth: 0.85mm; Lead Free: Lead Free; REACH SVHC: Unknown; Military Standard: Not; ComponentLink1URL: https://datasheet.ciiva.com/2525/dcrcwe3-2525359.pdf?src-supplier=Digi-Key; ComponentLink1Description: https://datasheet.ciiva.com/2525/dcrcwe3-2525359.pdf?src-supplier=Digi-Key; ComponentLink2URL: https://datasheet.ciiva.com/22708/1697337-22708351.pdf?src-supplier=Element14; ComponentLink2Description: https://datasheet.ciiva.com/22708/1697337-22708351.pdf?src-supplier=Element14; ComponentLink3URL: https://datasheet.ciiva.com/2525/dcrcwe3-2525360.pdf?src-supplier=Digi-Key; ComponentLink3Description: https://datasheet.ciiva.com/2525/dcrcwe3-2525360.pdf?src-supplier=Digi-Key; ComponentLink4URL: https://datasheet.ciiva.com/2525/dcrcwe3-2525361.pdf?src-supplier=Digi-Key; ComponentLink4Description: https://datasheet.ciiva.com/2525/dcrcwe3-2525361.pdf?src-supplier=Digi-Key; ComponentLink5URL: https://datasheet.ciiva.com/5541/dcrcwe3-109170-5541621.pdf?src-supplier=Mouser; ComponentLink5Description: https://datasheet.ciiva.com/5541/dcrcwe3-109170-5541621.pdf?src-supplier=Mouser; ComponentLink6URL: https://datasheet.ciiva.com/22676/1700796-22676828.pdf?src-supplier=Element14; ComponentLink6Description: https://datasheet.ciiva.com/22676/1700796-22676828.pdf?src-supplier=Element14
R10 = CMP-009-00177-2: Resistor 33MΩ 5% 0603; Manufacturer 1: Stackpole Electronics; Manufacturer Part Number 1: HMC0603JT33M0; Temperature Coefficient: 400ppm/°C; Resistance: 33MR; Max Power Dissipation: 100mW; Supplier 1: Digi-Key; Supplier Part Number 1: HMC0603JT33M0CT-ND; RoHS: Yes; Category: Chip SMD Resistors; Stock 1: 9469; Pricing 1: 1=0.42000, 10=0.30200, 100=0.12080, 1000=0.05950, 2500=0.05512 (USD); Mount: Surface Mount; Case/Package: 0603; Case Code (Imperial): 0603; Case Code (Metric): 1608; Min Operating Temperature: -55°C; Max Operating Temperature: 125°C; Tolerance: 5%; Resistor Type: Thick Film; Packaging: Tape and Reel; Number of Terminations: 2; Package Quantity: 5000; Length: 0.063inch; Width: 0.031inch; Height: 0.022inch; ComponentLink1URL: https://www.seielect.com/catalog/sei-hmc.pdf?src-supplier=Digi-Key; ComponentLink1Description: https://www.seielect.com/catalog/sei-hmc.pdf?src-supplier=Digi-Key; ComponentLink2URL: http://www.seielect.com/Catalog/SEI-HMC.pdf?src-supplier=Digi-Key; ComponentLink2Description: http://www.seielect.com/Catalog/SEI-HMC.pdf?src-supplier=Digi-Key
R14 = CMP-009-00177-2: Resistor 536kΩ 1% 0603; Manufacturer: Panasonic; Manufacturer Part Number: ERJ-3EKF5363V; Resistance: 536kR; Temperature Coefficient: 100ppm/°C; Power Rating: 100mW; Voltage Rating: 75V; Voltage Rating (DC): 50V; Supplier 1: Digi-Key; Supplier Part Number 1: P536KHCT-ND; RoHS: Yes; Category: Chip SMD Resistors; Stock 1: 78869; Pricing 1: 1=0.10000, 10=0.03200, 100=0.01300, 1000=0.00583, 2500=0.00506 (USD); Mount: Surface Mount; Case/Package: 0603; Case Code (Imperial): 0603; Case Code (Metric): 1608; Contact Plating: Tin; Weight: 7.1E-05oz; Min Operating Temperature: -55°C; Max Operating Temperature: 155°C; Tolerance: 1%; Packaging: Tape and Reel; Resistor Type: Thick Film; Number of Terminations: 2; Max Power Dissipation: 100mW; Package Quantity: 1; Termination: SMD/SMT; Features: Automotive AEC-Q200; Length: 1.6mm; Width: 0.8mm; Height: 0.45mm; Depth: 0.8mm; Lead Free: Lead Free; REACH SVHC: No SVHC; Military Standard: Not; ComponentLink1URL: https://datasheet.ciiva.com/22668/1678782-22668422.pdf?src-supplier=Element14; ComponentLink1Description: https://datasheet.ciiva.com/22668/1678782-22668422.pdf?src-supplier=Element14; ComponentLink2URL: https://datasheet.ciiva.com/46372/1678782-46372907.pdf?src-supplier=Element14; ComponentLink2Description: https://datasheet.ciiva.com/46372/1678782-46372907.pdf?src-supplier=Element14; ComponentLink3URL: https://datasheet.ciiva.com/46372/1678782-46372908.pdf?src-supplier=Element14; ComponentLink3Description: https://datasheet.ciiva.com/46372/1678782-46372908.pdf?src-supplier=Element14; ComponentLink4URL: https://datasheet.ciiva.com/9181/aoa0000ce2-9181295.pdf?src-supplier=Avnet; ComponentLink4Description: https://datasheet.ciiva.com/9181/aoa0000ce2-9181295.pdf?src-supplier=Avnet; ComponentLink5URL: https://datasheet.ciiva.com/30184/aoa0000ce2-30184767.pdf?src-supplier=Onlinecomponents.com; ComponentLink5Description: https://datasheet.ciiva.com/30184/aoa0000ce2-30184767.pdf?src-supplier=Onlinecomponents.com
R15 = CMP-009-00177-2: Resistor 3.3MΩ 1% 0603; Manufacturer 1: Samsung; Manufacturer Part Number 1: RC1608F335CS; Resistance: 3.3MR; Temperature Coefficient: 100ppm/°C; Max Power Dissipation: 100mW; Voltage Rating (DC): 50V; Supplier 1: Arrow Electronics; Supplier Part Number 1: RC1608F335CS; RoHS: Yes; Category: Chip SMD Resistors; Stock 1: 395352; Pricing 1: 1=0.00290, 100=0.00280, 3000=0.00260 (USD); Case/Package: 0603; Case Code (Imperial): 0603; Case Code (Metric): 1608; Contact Plating: Tin; Min Operating Temperature: -55°C; Max Operating Temperature: 155°C; Resistor Type: Thick Film; Packaging: Tape and Reel; Tolerance: 1%; Number of Terminations: 2; Features: Moisture Resistant; Power Rating: 100mW; Length: 0.063inch; Width: 0.031inch; Height: 0.022inch; Radiation Hardening: No; Lead Free: Lead Free; ComponentLink1URL: https://datasheet.ciiva.com/29169/454595-da-01-en-widerstand-0603-29169963.pdf?src-supplier=Conrad; ComponentLink1Description: https://datasheet.ciiva.com/29169/454595-da-01-en-widerstand-0603-29169963.pdf?src-supplier=Conrad; ComponentLink2URL: https://datasheet.ciiva.com/26334/436199-da-01-en-smd-widerstand-0603-rc-1608-3m30-1-0-1w-26334469.pdf?src-supplier=Conrad; ComponentLink2Description: https://datasheet.ciiva.com/26334/436199-da-01-en-smd-widerstand-0603-rc-1608-3m30-1-0-1w-26334469.pdf?src-supplier=Conrad; ComponentLink3URL: https://datasheet.ciiva.com/26155/chip-resistor-150112-1-26155077.pdf?src-supplier=Digi-Key; ComponentLink3Description: https://datasheet.ciiva.com/26155/chip-resistor-150112-1-26155077.pdf?src-supplier=Digi-Key
R17 R21 = CMP-009-00177-2: Resistor Ω % 0603; Manufacturer 1: Vishay; Manufacturer Part Number 1: CRCW06031M00FKEA; Tolerance: 1%; Resistance: 1MR; Temperature Coefficient: 100ppm/°C; Power Rating: 100mW; Voltage Rating: 75V; Supplier 1: Digi-Key; Supplier Part Number 1: 541-1.00MHCT-ND; RoHS: Yes; Category: Chip SMD Resistors; Stock 1: 268304; Pricing 1: 1=0.10000, 10=0.03100, 100=0.01260, 1000=0.00567, 2500=0.00492 (USD); Mount: Surface Mount; Case/Package: 0603; Number of Pins: 2; Case Code (Imperial): 0603; Case Code (Metric): 1608; Contact Plating: Tin; Weight: 7.1E-05oz; Min Operating Temperature: -55°C; Max Operating Temperature: 155°C; Packaging: Tape and Reel; Resistor Type: Thick Film; Number of Terminations: 2; Package Quantity: 10; Max Power Dissipation: 100mW; Termination: SMD/SMT; Features: Automotive AEC-Q200; Voltage Rating (DC): 75V; Length: 1.55mm; Width: 0.85mm; Height: 0.45mm; Depth: 0.85mm; Radiation Hardening: No; Lead Free: Lead Free; Military Standard: Not; REACH SVHC: Unknown; ComponentLink1URL: https://datasheet.ciiva.com/11809/0900766b80d98afc-11809074.pdf?src-supplier=RSComponents; ComponentLink1Description: https://datasheet.ciiva.com/11809/0900766b80d98afc-11809074.pdf?src-supplier=RSComponents; ComponentLink2URL: https://datasheet.ciiva.com/16311/dcrcwe3-16311533.pdf?src-supplier=Future+Electronics; ComponentLink2Description: https://datasheet.ciiva.com/16311/dcrcwe3-16311533.pdf?src-supplier=Future+Electronics; ComponentLink3URL: https://datasheet.ciiva.com/7841/125364-7841823.pdf?src-supplier=Element14; ComponentLink3Description: https://datasheet.ciiva.com/7841/125364-7841823.pdf?src-supplier=Element14; ComponentLink4URL: https://datasheet.ciiva.com/26314/fld-crcw-e3-data-en-26314645.pdf?src-supplier=Distrelec; ComponentLink4Description: https://datasheet.ciiva.com/26314/fld-crcw-e3-data-en-26314645.pdf?src-supplier=Distrelec; ComponentLink5URL: https://datasheet.ciiva.com/2465/dcrcwe3-2465549.pdf?src-supplier=Digi-Key; ComponentLink5Description: https://datasheet.ciiva.com/2465/dcrcwe3-2465549.pdf?src-supplier=Digi-Key; ComponentLink6URL: https://datasheet.ciiva.com/2465/dcrcwe3-2465550.pdf?src-supplier=Digi-Key; ComponentLink6Description: https://datasheet.ciiva.com/2465/dcrcwe3-2465550.pdf?src-supplier=Digi-Key; ComponentLink7URL: https://datasheet.ciiva.com/7841/1720486-7841822.pdf?src-supplier=Element14; ComponentLink7Description: https://datasheet.ciiva.com/7841/1720486-7841822.pdf?src-supplier=Element14; ComponentLink8URL: https://datasheet.ciiva.com/2465/dcrcwe3-2465551.pdf?src-supplier=Digi-Key; ComponentLink8Description: https://datasheet.ciiva.com/2465/dcrcwe3-2465551.pdf?src-supplier=Digi-Key
R18 = CMP-009-00177-2: Resistor Ω % 0603; Manufacturer 1: Vishay; Manufacturer Part Number 1: CRCW0603180KFKEA; Resistance: 180kR; Temperature Coefficient: 100ppm/°C; Power Rating: 100mW; Voltage Rating: 75V; Supplier 1: Digi-Key; Supplier Part Number 1: 541-180KHCT-ND; RoHS: Yes; Category: Chip SMD Resistors; Stock 1: 43132; Pricing 1: 1=0.10000, 10=0.03100, 100=0.01260, 1000=0.00567, 2500=0.00492 (USD); Case/Package: 0603; Case Code (Imperial): 0603; Case Code (Metric): 1608; Contact Plating: Tin; Weight: 7.1E-05oz; Min Operating Temperature: -55°C; Max Operating Temperature: 155°C; Resistor Type: Thick Film; Tolerance: 1%; Packaging: Tape and Reel; Number of Terminations: 2; Max Power Dissipation: 100mW; Package Quantity: 10; Termination: SMD/SMT; Features: Automotive AEC-Q200; Voltage Rating (DC): 75V; Length: 1.55mm; Width: 0.85mm; Height: 0.45mm; Depth: 0.85mm; Radiation Hardening: No; Lead Free: Lead Free; Military Standard: Not; REACH SVHC: Unknown; ComponentLink1URL: https://datasheet.ciiva.com/11810/0900766b80d98afc-11810934.pdf?src-supplier=RSComponents; ComponentLink1Description: https://datasheet.ciiva.com/11810/0900766b80d98afc-11810934.pdf?src-supplier=RSComponents; ComponentLink2URL: https://datasheet.ciiva.com/16893/dcrcwe3-16893717.pdf?src-supplier=Avnet+Europe; ComponentLink2Description: https://datasheet.ciiva.com/16893/dcrcwe3-16893717.pdf?src-supplier=Avnet+Europe; ComponentLink3URL: https://datasheet.ciiva.com/2466/dcrcwe3-2466614.pdf?src-supplier=Digi-Key; ComponentLink3Description: https://datasheet.ciiva.com/2466/dcrcwe3-2466614.pdf?src-supplier=Digi-Key; ComponentLink4URL: https://datasheet.ciiva.com/2466/dcrcwe3-2466615.pdf?src-supplier=Digi-Key; ComponentLink4Description: https://datasheet.ciiva.com/2466/dcrcwe3-2466615.pdf?src-supplier=Digi-Key; ComponentLink5URL: https://datasheet.ciiva.com/2466/dcrcwe3-2466616.pdf?src-supplier=Digi-Key; ComponentLink5Description: https://datasheet.ciiva.com/2466/dcrcwe3-2466616.pdf?src-supplier=Digi-Key; ComponentLink6URL: https://datasheet.ciiva.com/7714/1697337-7714238.pdf?src-supplier=Element14; ComponentLink6Description: https://datasheet.ciiva.com/7714/1697337-7714238.pdf?src-supplier=Element14; ComponentLink7URL: https://datasheet.ciiva.com/16213/dcrcwe3-16213022.pdf?src-supplier=Future+Electronics; ComponentLink7Description: https://datasheet.ciiva.com/16213/dcrcwe3-16213022.pdf?src-supplier=Future+Electronics; ComponentLink8URL: https://datasheet.ciiva.com/16761/70201119-16761471.pdf?src-supplier=Allied+Electronics; ComponentLink8Description: https://datasheet.ciiva.com/16761/70201119-16761471.pdf?src-supplier=Allied+Electronics; ComponentLink9URL: https://datasheet.ciiva.com/3257/dcrcwe3-3257100.pdf?src-supplier=Avnet; ComponentLink9Description: https://datasheet.ciiva.com/3257/dcrcwe3-3257100.pdf?src-supplier=Avnet
R19 = CMP-009-00177-2: Resistor Ω % 0603; Manufacturer: Vishay; Manufacturer Part Number: CRCW06031M00FKEA; Tolerance: 1%; Resistance: 1MR; Temperature Coefficient: 100ppm/°C; Power Rating: 100mW; Voltage Rating: 75V; Supplier 1: Digi-Key; Supplier Part Number 1: 541-1.00MHCT-ND; RoHS: Yes; Category: Chip SMD Resistors; Stock 1: 268304; Pricing 1: 1=0.10000, 10=0.03100, 100=0.01260, 1000=0.00567, 2500=0.00492 (USD); Mount: Surface Mount; Case/Package: 0603; Number of Pins: 2; Case Code (Imperial): 0603; Case Code (Metric): 1608; Contact Plating: Tin; Weight: 7.1E-05oz; Min Operating Temperature: -55°C; Max Operating Temperature: 155°C; Packaging: Tape and Reel; Resistor Type: Thick Film; Number of Terminations: 2; Package Quantity: 10; Max Power Dissipation: 100mW; Termination: SMD/SMT; Features: Automotive AEC-Q200; Voltage Rating (DC): 75V; Length: 1.55mm; Width: 0.85mm; Height: 0.45mm; Depth: 0.85mm; Radiation Hardening: No; Lead Free: Lead Free; Military Standard: Not; REACH SVHC: Unknown; ComponentLink1URL: https://datasheet.ciiva.com/11809/0900766b80d98afc-11809074.pdf?src-supplier=RSComponents; ComponentLink1Description: https://datasheet.ciiva.com/11809/0900766b80d98afc-11809074.pdf?src-supplier=RSComponents; ComponentLink2URL: https://datasheet.ciiva.com/16311/dcrcwe3-16311533.pdf?src-supplier=Future+Electronics; ComponentLink2Description: https://datasheet.ciiva.com/16311/dcrcwe3-16311533.pdf?src-supplier=Future+Electronics; ComponentLink3URL: https://datasheet.ciiva.com/7841/125364-7841823.pdf?src-supplier=Element14; ComponentLink3Description: https://datasheet.ciiva.com/7841/125364-7841823.pdf?src-supplier=Element14; ComponentLink4URL: https://datasheet.ciiva.com/26314/fld-crcw-e3-data-en-26314645.pdf?src-supplier=Distrelec; ComponentLink4Description: https://datasheet.ciiva.com/26314/fld-crcw-e3-data-en-26314645.pdf?src-supplier=Distrelec; ComponentLink5URL: https://datasheet.ciiva.com/2465/dcrcwe3-2465549.pdf?src-supplier=Digi-Key; ComponentLink5Description: https://datasheet.ciiva.com/2465/dcrcwe3-2465549.pdf?src-supplier=Digi-Key; ComponentLink6URL: https://datasheet.ciiva.com/2465/dcrcwe3-2465550.pdf?src-supplier=Digi-Key; ComponentLink6Description: https://datasheet.ciiva.com/2465/dcrcwe3-2465550.pdf?src-supplier=Digi-Key; ComponentLink7URL: https://datasheet.ciiva.com/7841/1720486-7841822.pdf?src-supplier=Element14; ComponentLink7Description: https://datasheet.ciiva.com/7841/1720486-7841822.pdf?src-supplier=Element14; ComponentLink8URL: https://datasheet.ciiva.com/2465/dcrcwe3-2465551.pdf?src-supplier=Digi-Key; ComponentLink8Description: https://datasheet.ciiva.com/2465/dcrcwe3-2465551.pdf?src-supplier=Digi-Key
R20 = CMP-009-00177-2: Resistor Ω % 0603; Manufacturer 1: Yageo; Manufacturer Part Number 1: RC0603FR-07100KL; Resistance: 100kR; Temperature Coefficient: 100ppm/°C; Power Rating: 100mW; Voltage Rating: 50V; Working Voltage: 75V; Supplier 1: Digi-Key; Supplier Part Number 1: 311-100KHRCT-ND; RoHS: Yes; Category: Chip SMD Resistors; Stock 1: 10268838; Pricing 1: 1=0.10000, 10=0.02100, 100=0.00850, 1000=0.00382, 2500=0.00331 (USD); Case/Package: 0603; Number of Pins: 2; Case Code (Imperial): 0603; Case Code (Metric): 1608; Min Operating Temperature: -55°C; Max Operating Temperature: 155°C; Tolerance: 1%; Packaging: Tape and Reel; Resistor Type: Thick Film; Termination: SMD/SMT; Number of Terminations: 2; Voltage Rating (DC): 50V; Length: 1.6mm; Width: 0.8mm; Height: 0.45mm; Depth: 0.8mm; Lead Free: Lead Free; Military Standard: Not; REACH SVHC: No SVHC; ComponentLink1URL: https://datasheet.ciiva.com/11808/0900766b80f96399-11808107.pdf?src-supplier=RSComponents; ComponentLink1Description: https://datasheet.ciiva.com/11808/0900766b80f96399-11808107.pdf?src-supplier=RSComponents; ComponentLink2URL: https://datasheet.ciiva.com/7983/443971-7983593.pdf?src-supplier=Element14; ComponentLink2Description: https://datasheet.ciiva.com/7983/443971-7983593.pdf?src-supplier=Element14; ComponentLink3URL: https://datasheet.ciiva.com/46440/1868787-46440889.pdf?src-supplier=Element14; ComponentLink3Description: https://datasheet.ciiva.com/46440/1868787-46440889.pdf?src-supplier=Element14; ComponentLink4URL: https://datasheet.ciiva.com/7746/1738695-7746234.pdf?src-supplier=Element14; ComponentLink4Description: https://datasheet.ciiva.com/7746/1738695-7746234.pdf?src-supplier=Element14; ComponentLink5URL: https://datasheet.ciiva.com/7746/1738695-7746235.pdf?src-supplier=Element14; ComponentLink5Description: https://datasheet.ciiva.com/7746/1738695-7746235.pdf?src-supplier=Element14; ComponentLink6URL: https://datasheet.ciiva.com/22747/443971-22747516.pdf?src-supplier=Element14; ComponentLink6Description: https://datasheet.ciiva.com/22747/443971-22747516.pdf?src-supplier=Element14
SB3 SB4 = CMP-009-00178-4: Normally closed solder jumper
SB5 = CMP-009-00179-1: Normally open solder jumper
TP1-TP8 = CMP-00028-00002-2: 0.6mm round test point; Pins: 1
U2 = CMP-005-0000-4: Battery Management Low Pwr Harvester Pwr Mgmt IC; Operating Supply Voltage: 4V; Output Current: 100mA; Operating Supply Current: 488nA; Switching Frequency: 1MHz; Min Operating Temperature: -40°C; Max Operating Temperature: 125°C; Case/Package: VQFN; Package Quantity: 3000; Number of Pins: 20; Packaging: Tape and Reel; Contact Plating: Gold; Mount: Surface Mount; Lead Free: Lead Free
U6 U7 = CMP-019-00049-1: IC REG BOOST ADJ .5A NANO 6UDFN; Synchronous Rectifier: Yes; Switching Frequency: 2.5MHz; Output Current: 500mA; Min Input Voltage: 400mV; Number of Outputs: 1; Output Configuration: Positive; Output Type: Adjustable; Min Output Voltage: 1.8V; Max Input Voltage: 5.5V; Max Output Voltage: 5V; Max Operating Temperature: 85°C; Min Operating Temperature: -40°C; Topology: Boost; Number of Pins: 6; Mount: Surface Mount; Packaging: Tape and Reel